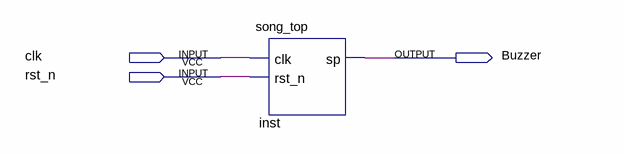
[diagram p0: schematic sheet]
// Quartus schematic buzzer(1).bdf as structural Verilog: 1 symbols, 3 pins
module \buzzer(1)  (
  input  clk,
  input  rst_n,
  output Buzzer
);

  song_top inst (.clk(clk), .rst_n(rst_n), .sp(Buzzer));
endmodule
